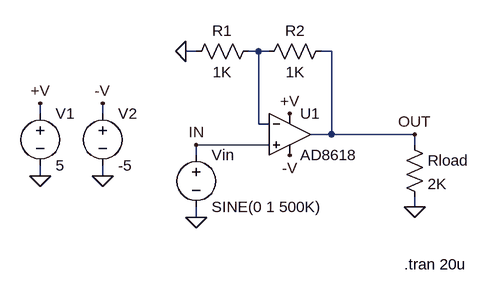
[diagram p0: schematic AD8618.asc]
AD8618.asc, the LTspice schematic file:
Version 4
SHEET 1 1240 700
WIRE 416 -1184 400 -1184
WIRE 512 -1184 496 -1184
WIRE 528 -1184 512 -1184
WIRE 624 -1184 608 -1184
WIRE 176 -1088 176 -1104
WIRE 272 -1088 272 -1104
WIRE 512 -1072 512 -1184
WIRE 528 -1072 512 -1072
WIRE 624 -1056 624 -1184
WIRE 624 -1056 592 -1056
WIRE 752 -1056 624 -1056
WIRE 528 -1040 416 -1040
WIRE 752 -1040 752 -1056
WIRE 416 -1024 416 -1040
WIRE 176 -992 176 -1008
WIRE 272 -992 272 -1008
WIRE 752 -944 752 -960
WIRE 416 -928 416 -944
FLAG 416 -928 0
FLAG 752 -1056 OUT
FLAG 416 -1040 IN
FLAG 560 -1088 +V
FLAG 560 -1024 -V
FLAG 400 -1184 0
FLAG 752 -944 0
FLAG 176 -1104 +V
FLAG 176 -992 0
FLAG 272 -1104 -V
FLAG 272 -992 0
SYMBOL voltage 416 -1040 R0
WINDOW 123 24 146 Left 2
WINDOW 39 24 125 Left 2
SYMATTR InstName Vin
SYMATTR Value SINE(0 1 500K)
SYMBOL res 512 -1200 R90
WINDOW 0 0 56 VBottom 2
WINDOW 3 32 56 VTop 2
SYMATTR InstName R1
SYMATTR Value 1K
SYMBOL res 624 -1200 R90
WINDOW 0 0 56 VBottom 2
WINDOW 3 32 56 VTop 2
SYMATTR InstName R2
SYMATTR Value 1K
SYMBOL Opamps\\AD8618 560 -1120 R0
SYMATTR InstName U1
SYMBOL res 736 -1056 R0
SYMATTR InstName Rload
SYMATTR Value 2K
SYMBOL voltage 176 -1104 R0
WINDOW 123 0 0 Left 2
WINDOW 39 0 0 Left 2
SYMATTR InstName V1
SYMATTR Value 5
SYMBOL voltage 272 -1104 R0
WINDOW 123 24 146 Left 2
WINDOW 39 24 125 Left 2
SYMATTR InstName V2
SYMATTR Value -5
TEXT 736 -856 Left 2 !.tran 20u

The netlist it stands for:
* AD8618.asc
Vin IN 0 SINE(0 1 500K)
R1 N001 0 1K
R2 OUT N001 1K
XU1 IN N001 +V -V OUT AD8618  ; pins In+ In- V+ V- OUT
Rload OUT 0 2K
V1 +V 0 5
V2 -V 0 -5
.tran 20u
.backanno
.end